# EAGLE design quadcopter_cape_v1 (EAGLE 6.5.0)
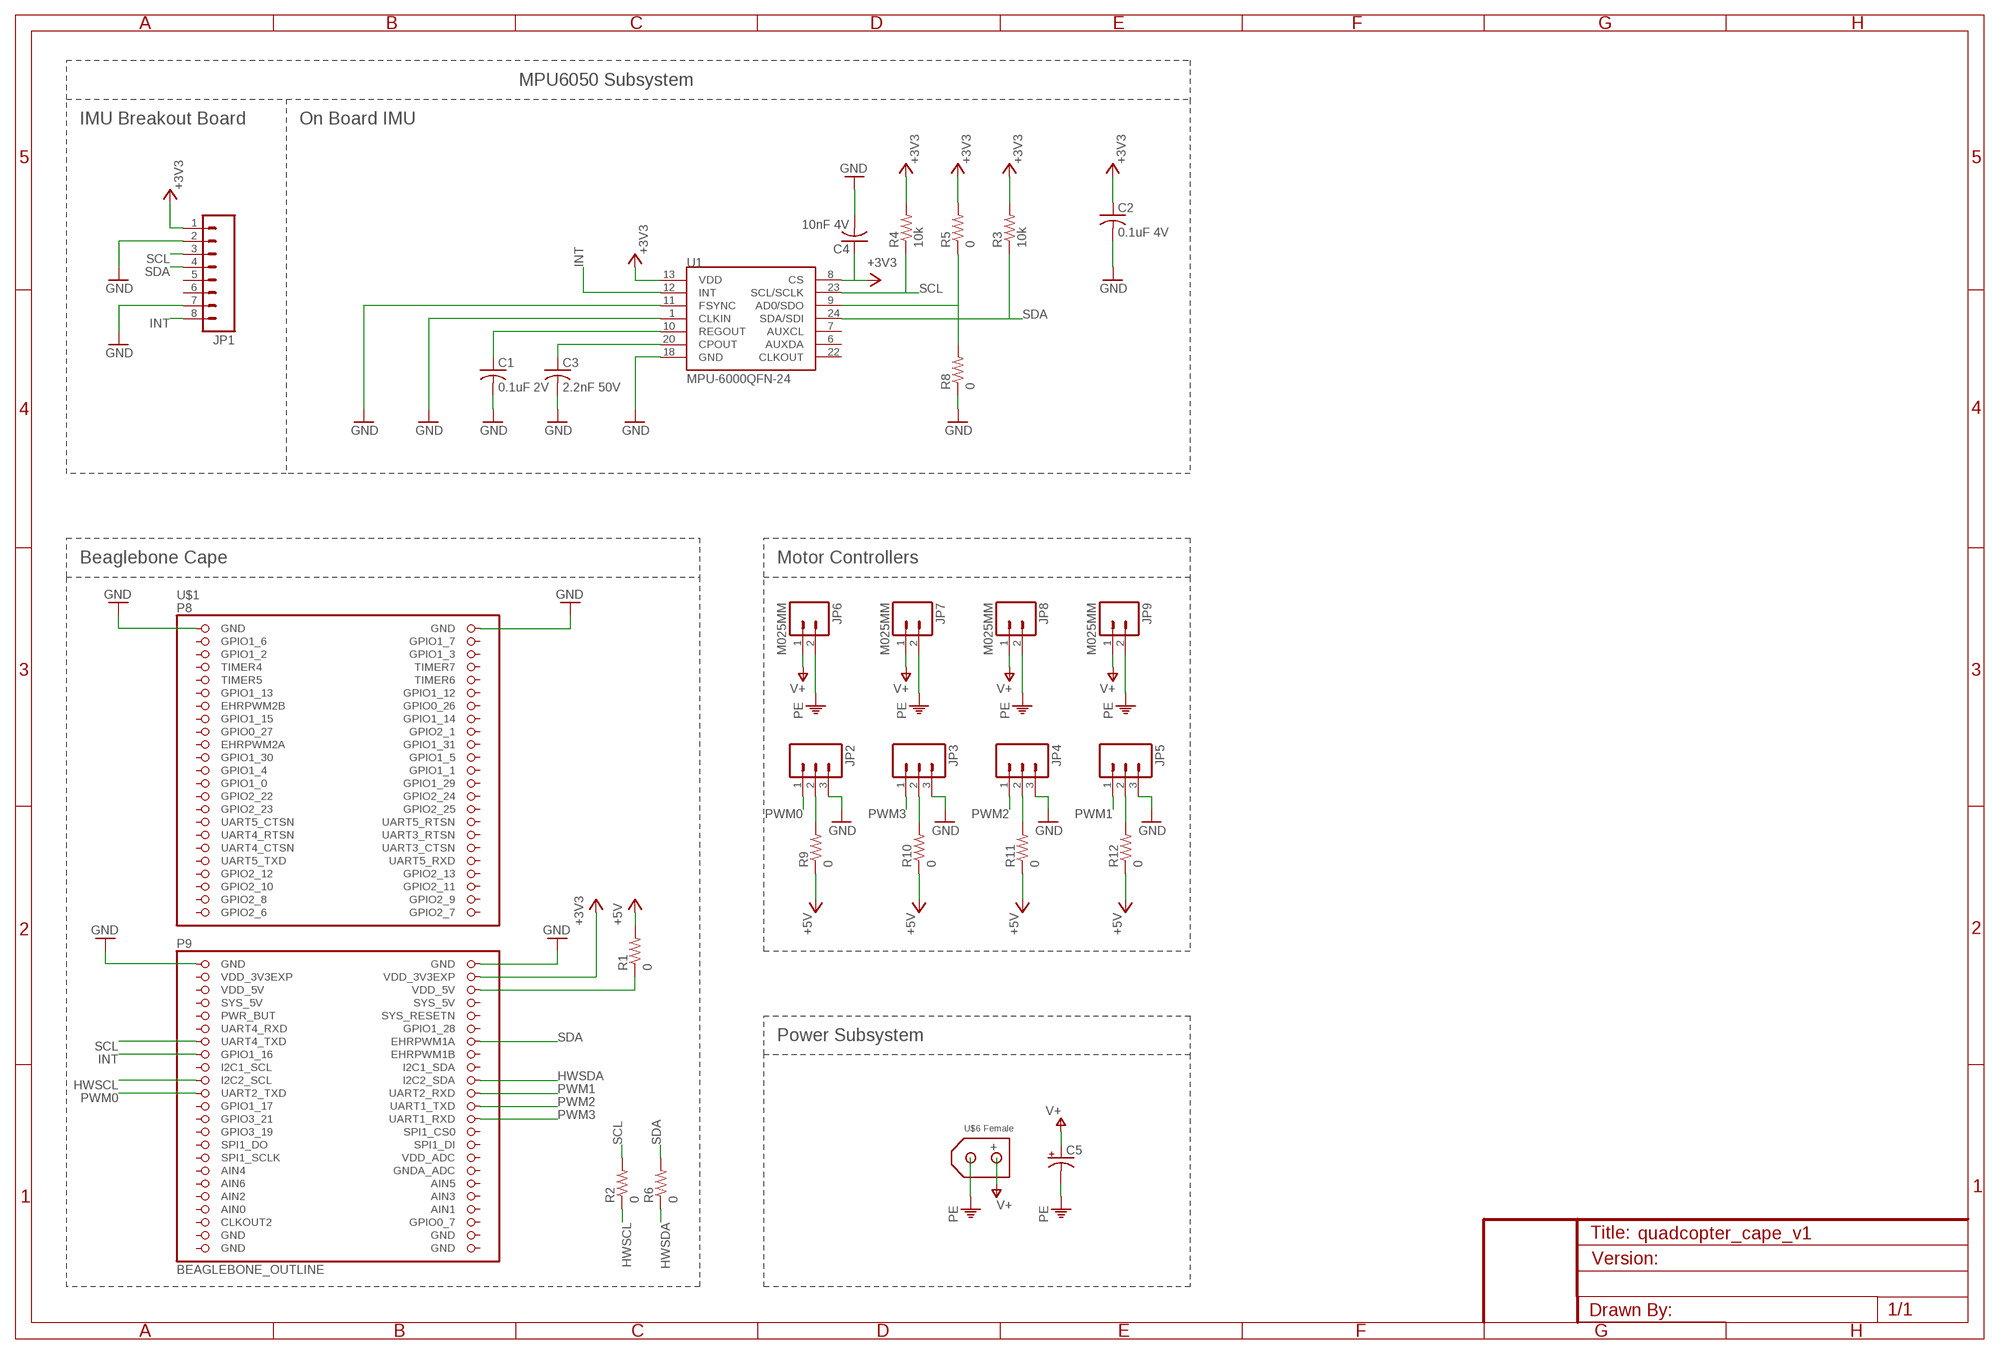
[diagram p0: schematic, sheet 1]

## Parts
C1  0.1uF 2V  C-USC0603  [C0603]
C2  0.1uF 4V  C-USC0603  [C0603]
C3  2.2nF 50V  C-USC0603  [C0603]
C4  10nF 4V  C-USC0603  [C0603]
C5  10UF-25V-20%(PTH)  [CPOL-RADIAL-10UF-25V]
JP1  M081X08  [1X08]
JP2  M03PTH  [1X03]
JP3  M03PTH  [1X03]
JP4  M03PTH  [1X03]
JP5  M03PTH  [1X03]
JP6  M025MM  [SCREWTERMINAL-5MM-2]
JP7  M025MM  [SCREWTERMINAL-5MM-2]
JP8  M025MM  [SCREWTERMINAL-5MM-2]
JP9  M025MM  [SCREWTERMINAL-5MM-2]
R1  0  R-US_R0603  [R0603]
R2  0  R-US_R0603  [R0603]
R3  10k  R-US_R0603  [R0603]
R4  10k  R-US_R0603  [R0603]
R5  0  R-US_R0603  [R0603]
R6  0  R-US_R0603  [R0603]
R8  0  R-US_R0603  [R0603]
R9  0  R-US_R0603  [R0603]
R10  0  R-US_R0603  [R0603]
R11  0  R-US_R0603  [R0603]
R12  0  R-US_R0603  [R0603]
U1  MPU-6000QFN-24  [QFN-24-TESTING]
U$1  BEAGLEBONE_OUTLINE  [BEAGLEBONE_SHIELD]
U$6  XT60  [XT60]

## Nets
+3V3: C2.1 C4.1 JP1.1 R3.2 R4.2 R5.2 U1.8(CS) U1.13(VDD) U$1.50(VDD_3V3EXP)
+5V: R1.2 R9.1 R10.1 R11.1 R12.1
GND: C1.2 C2.2 C3.2 C4.2 JP1.2 JP1.7 JP2.3 JP3.3 JP4.3 JP5.3 R8.1 U1.1(CLKIN) U1.11(FSYNC) U1.18(GND) U$1.1(GND) U$1.2(GND) U$1.47(GND) U$1.48(GND)
HWSCL: R2.1 U$1.65(I2C2_SCL)
HWSDA: R6.1 U$1.66(I2C2_SDA)
INT: JP1.8 U1.12(INT) U$1.61(GPIO1_16)
N$1: R1.1 U$1.52(VDD_5V)
N$3: C1.1 U1.10(REGOUT)
N$4: C3.1 U1.20(CPOUT)
N$5: R5.1 R8.2 U1.9(AD0/SDO)
N$10: JP2.2 R9.2
N$11: JP3.2 R10.2
N$12: JP4.2 R11.2
N$13: JP5.2 R12.2
PE: C5.2(-) JP6.2 JP7.2 JP8.2 JP9.2 U$6.GND
PWM0: JP2.1 U$1.67(UART2_TXD)
PWM1: JP5.1 U$1.68(UART2_RXD)
PWM2: JP4.1 U$1.70(UART1_TXD)
PWM3: JP3.1 U$1.72(UART1_RXD)
SCL: JP1.3 R2.2 R4.1 U1.23(SCL/SCLK) U$1.59(UART4_TXD)
SDA: JP1.4 R3.1 R6.2 U1.24(SDA/SDI) U$1.60(EHRPWM1A)
V+: C5.1(+) JP6.1 JP7.1 JP8.1 JP9.1 U$6.PWR
Unconnected: JP1.5 JP1.6 U1.6(AUXDA) U1.7(AUXCL) U1.22(CLKOUT) U$1.3(GPIO1_6) U$1.4(GPIO1_7) U$1.5(GPIO1_2) U$1.6(GPIO1_3) U$1.7(TIMER4) U$1.8(TIMER7) U$1.9(TIMER5) U$1.10(TIMER6) U$1.11(GPIO1_13) U$1.12(GPIO1_12) U$1.13(EHRPWM2B) U$1.14(GPIO0_26) U$1.15(GPIO1_15) U$1.16(GPIO1_14) U$1.17(GPIO0_27) U$1.18(GPIO2_1) U$1.19(EHRPWM2A) U$1.20(GPIO1_31) U$1.21(GPIO1_30) U$1.22(GPIO1_5) U$1.23(GPIO1_4) U$1.24(GPIO1_1) U$1.25(GPIO1_0) U$1.26(GPIO1_29) U$1.27(GPIO2_22) U$1.28(GPIO2_24) U$1.29(GPIO2_23) U$1.30(GPIO2_25) U$1.31(UART5_CTSN) U$1.32(UART5_RTSN) U$1.33(UART4_RTSN) U$1.34(UART3_RTSN) U$1.35(UART4_CTSN) U$1.36(UART3_CTSN) U$1.37(UART5_TXD) U$1.38(UART5_RXD) U$1.39(GPIO2_12) U$1.40(GPIO2_13) U$1.41(GPIO2_10) U$1.42(GPIO2_11) U$1.43(GPIO2_8) U$1.44(GPIO2_9) U$1.45(GPIO2_6) U$1.46(GPIO2_7) U$1.54(SYS_5V) U$1.55(PWR_BUT) U$1.56(SYS_RESETN) U$1.57(UART4_RXD) U$1.58(GPIO1_28) U$1.62(EHRPWM1B) U$1.63(I2C1_SCL) U$1.64(I2C1_SDA) U$1.69(GPIO1_17) U$1.71(GPIO3_21) U$1.73(GPIO3_19) U$1.74(SPI1_CS0) U$1.75(SPI1_DO) U$1.76(SPI1_DI) U$1.77(SPI1_SCLK) U$1.78(VDD_ADC) U$1.79(AIN4) U$1.80(GNDA_ADC) U$1.81(AIN6) U$1.82(AIN5) U$1.83(AIN2) U$1.84(AIN3) U$1.86(AIN1) U$1.87(CLKOUT2) U$1.88(GPIO0_7)

## Notes on the sheet
- MPU6050 Subsystem
- IMU Breakout Board | On Board IMU
- Beaglebone Cape | Motor Controllers
- Power Subsystem
- Female

## Power pins joined to a net without a drawn wire
AIN0: U$1.85(AIN0)
GND: U$1.89(GND) U$1.90(GND) U$1.91(GND) U$1.92(GND)
SYS_5V: U$1.53(SYS_5V)
VDD_3V3EXP: U$1.49(VDD_3V3EXP)
VDD_5V: U$1.51(VDD_5V)

## Library data of the parts
C1-C4 = resistor:C-US: CAPACITOR, American symbol
C5 = SparkFun-Capacitors:10UF-25V-20%(PTH): CAP-08440; PROD_ID: CAP-08440
JP1 = SparkFun-Connectors:M08: Header 8 Standard 8-pin 0.1" header. Use with straight break away headers (SKU : PRT-00116), right angle break away headers (PRT-00553), swiss pins (PRT-00743), machine pins (PRT-00117), and female headers (PRT-00115).
JP2-JP5 = SparkFun-Connectors:M03: Header 3 Standard 3-pin 0.1" header. Use with straight break away headers (SKU : PRT-00116), right angle break away headers (PRT-00553), swiss pins (PRT-00743), machine pins (PRT-00117), and female headers (PRT-00115). Molex polarized connector foot print use with SKU : PRT-08232 with associated crimp pins and housings.
JP6-JP9 = SparkFun-Connectors:M02: Standard 2-pin 0.1" header. Use with - straight break away headers ( PRT-00116) - right angle break away headers (PRT-00553) - swiss pins (PRT-00743) - machine pins (PRT-00117) - female headers (PRT-00115) Molex polarized connector foot print use with: PRT-08233 with associated crimp pins and housings. 2.54_SCREWTERM for use with PRT-10571. 3.5mm Screw Terminal footprints for PRT-08084 5mm Screw Terminal footprints for use with PRT-08433
R1-R6 R8-R12 = resistor:R-US_: RESISTOR, American symbol
U1 = SparkFun-Sensors:MPU-6000: MPU-6000 - I2C address is 0x68 with AD0 low and 0x69 with AD0 high.
U$1 = adafruit:BEAGLEBONE_OUTLINE: Should match A3 pinout - but not completely tested
U$6 = XT60:XT60

## Board
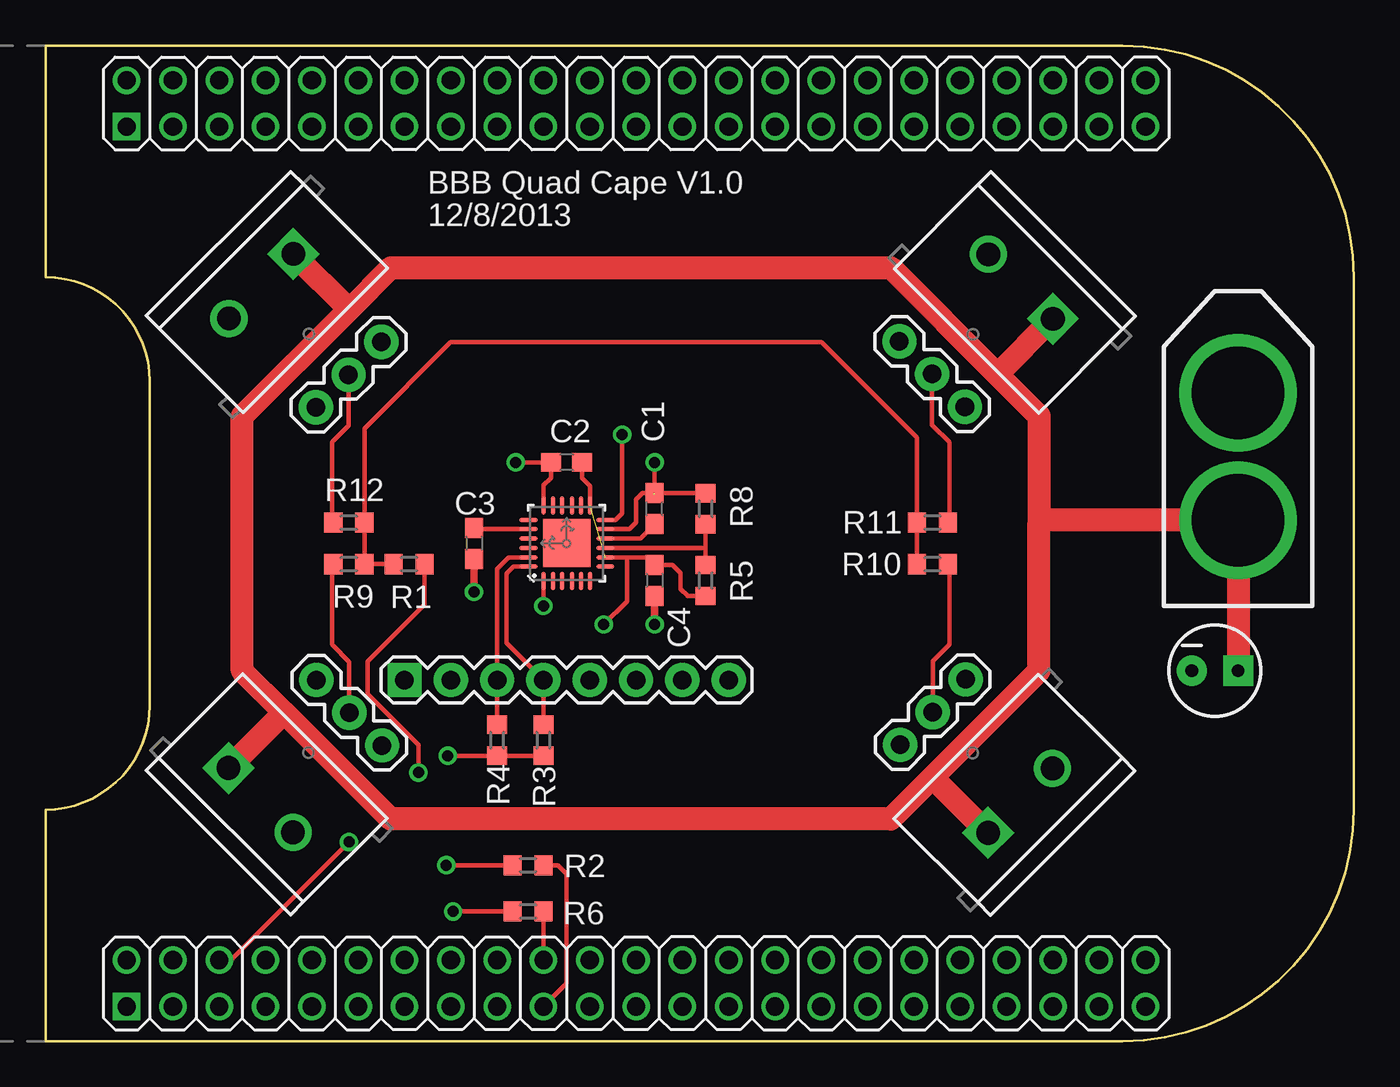
[diagram p1: board, top side]
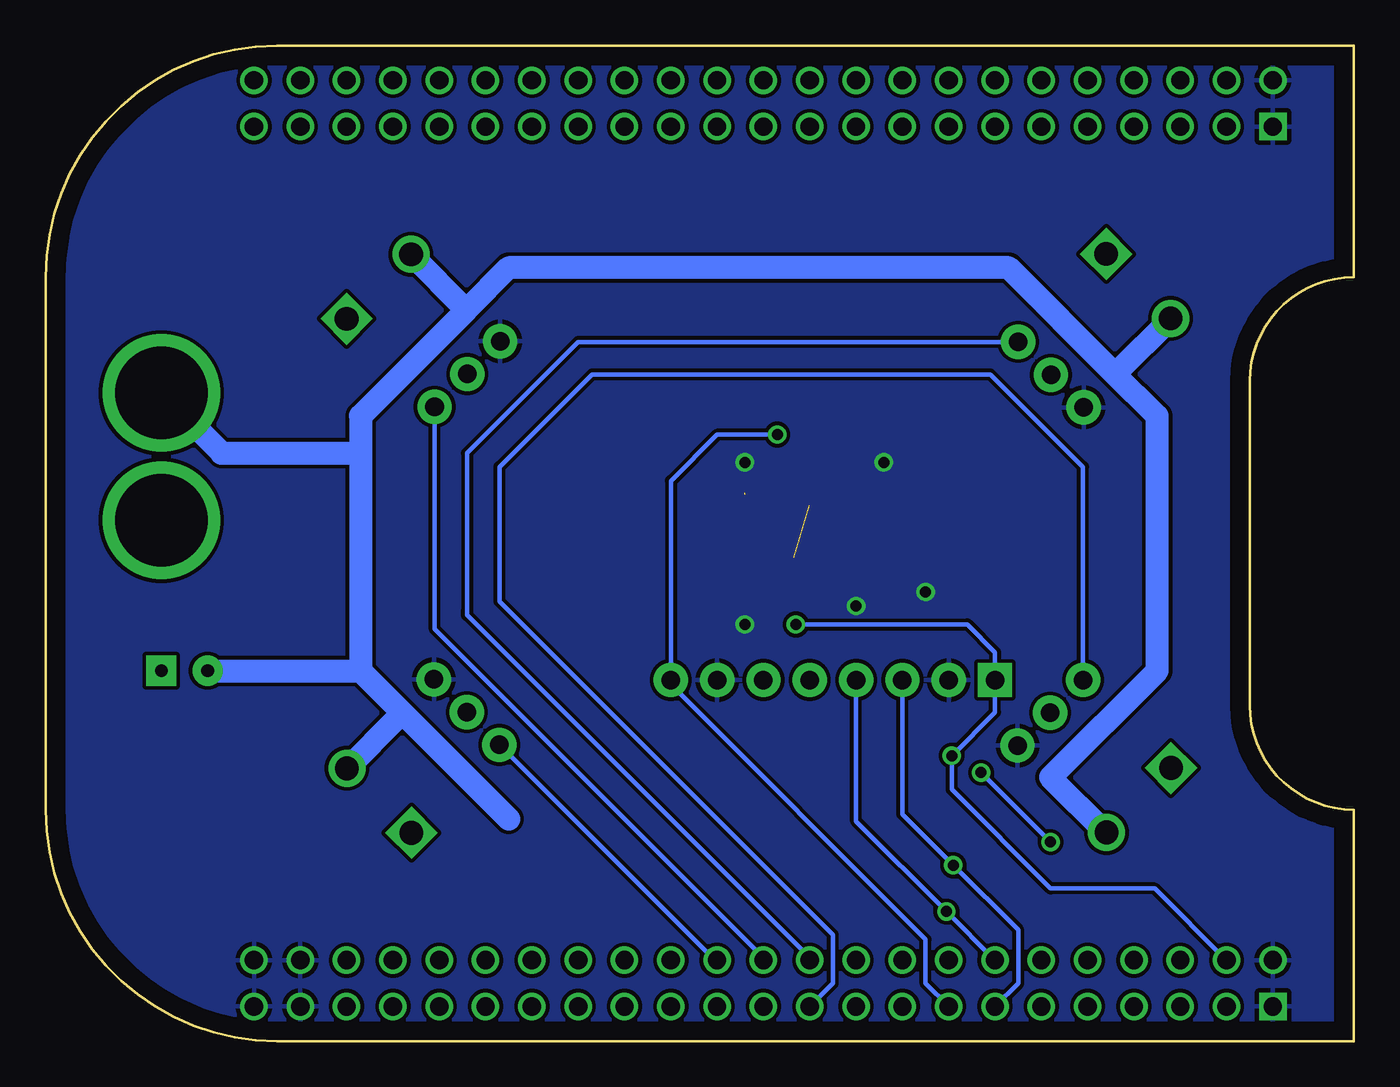
[diagram p2: board, bottom side, seen from below]

Size 71.75 x 54.61 mm. Coordinates in mm from the lower left corner, seen from the top.
Copper layers (1*16): Top 0.035mm / dielectric 1.5mm / Bottom 0.035mm
Design rules "default *": minimum track width 10mil, minimum drill 24mil, track to track 8mil, track to pad 8mil, pad to pad 8mil, via to via 8mil, smd to smd 8mil, copper to edge 40mil, drill to drill 8mil, minimum pad ring 10mil, minimum via ring 8mil, stop-mask expansion 4mil, vias tented up to drill 0mil, thermal gap 10mil

### Footprints (pad centres in the part's own frame; a part is rotated, then mirrored left to right if it is on the bottom)
C0603 = smd 1.1 x 1: 1 -0.85,0; 2 0.85,0
CPOL-RADIAL-10UF-25V = drill 0.7 pad 1.651 square: 1 1.27,0 | drill 0.7 pad 1.651: 2 -1.27,0
1X08 = drill 1.016 pad 1.88 square: 1 0,0 | drill 1.016 pad 1.88: 2 2.54,0; 3 5.08,0; 4 7.62,0; 5 10.16,0; 6 12.7,0; 7 15.24,0; 8 17.78,0
1X03 = drill 1.016 pad 1.88: 1 0,0; 2 2.54,0; 3 5.08,0
SCREWTERMINAL-5MM-2 = drill 1.3 pad 2.032 square: 1 0,0 | drill 1.3 pad 2.032: 2 5,0
R0603 = smd 1 x 1.1: 1 -0.85,0; 2 0.85,0
QFN-24-TESTING = smd 1.016 x 0.254: 1 -2.066,1.257; 2 -2.066,0.75; 3 -2.066,0.247; 4 -2.066,-0.287; 5 -2.066,-0.792; 6 -2.066,-1.297; 13 2.086,-1.297; 14 2.086,-0.792; 15 2.086,-0.287; 16 2.086,0.247; 17 2.086,0.75; 18 2.086,1.257 | smd 0.254 x 1.016: 7 -1.267,-2.122; 8 -0.762,-2.122; 9 -0.258,-2.122; 10 0.278,-2.122; 11 0.78,-2.122; 12 1.287,-2.122; 19 1.287,2.082; 20 0.78,2.082; 21 0.278,2.082; 22 -0.258,2.082; 23 -0.762,2.082; 24 -1.267,2.082 | smd 2.616 x 2.616: P$1 0.02,-0.01
BEAGLEBONE_SHIELD = drill 1 square: 1 4.445,19.05; 47 52.705,19.05 | drill 1: 2 1.905,19.05; 3 4.445,21.59; 4 1.905,21.59; 5 4.445,24.13; 6 1.905,24.13; 7 4.445,26.67; 8 1.905,26.67; 9 4.445,29.21; 10 1.905,29.21; 11 4.445,31.75; 12 1.905,31.75; 13 4.445,34.29; 14 1.905,34.29; 15 4.445,36.83; 16 1.905,36.83; 17 4.445,39.37; 18 1.905,39.37; 19 4.445,41.91; 20 1.905,41.91; 21 4.445,44.45; 22 1.905,44.45; 23 4.445,46.99; 24 1.905,46.99; 25 4.445,49.53; 26 1.905,49.53; 27 4.445,52.07; 28 1.905,52.07; 29 4.445,54.61; 30 1.905,54.61; 31 4.445,57.15; 32 1.905,57.15; 33 4.445,59.69; 34 1.905,59.69; 35 4.445,62.23; 36 1.905,62.23; 37 4.445,64.77; 38 1.905,64.77; 39 4.445,67.31; 40 1.905,67.31; 41 4.445,69.85; 42 1.905,69.85; 43 4.445,72.39; 44 1.905,72.39; 45 4.445,74.93; 46 1.905,74.93; 48 50.165,19.05; 49 52.705,21.59; 50 50.165,21.59; 51 52.705,24.13; 52 50.165,24.13; 53 52.705,26.67; 54 50.165,26.67; 55 52.705,29.21; 56 50.165,29.21; 57 52.705,31.75; 58 50.165,31.75; 59 52.705,34.29; 60 50.165,34.29; 61 52.705,36.83; 62 50.165,36.83; 63 52.705,39.37; 64 50.165,39.37; 65 52.705,41.91; 66 50.165,41.91; 67 52.705,44.45; 68 50.165,44.45; 69 52.705,46.99; 70 50.165,46.99; 71 52.705,49.53; 72 50.165,49.53; 73 52.705,52.07; 74 50.165,52.07; 75 52.705,54.61; 76 50.165,54.61; 77 52.705,57.15; 78 50.165,57.15; 79 52.705,59.69; 80 50.165,59.69; 81 52.705,62.23; 82 50.165,62.23; 83 52.705,64.77; 84 50.165,64.77; 85 52.705,67.31; 86 50.165,67.31; 87 52.705,69.85; 88 50.165,69.85; 89 52.705,72.39; 90 50.165,72.39; 91 52.705,74.93; 92 50.165,74.93
XT60 = drill 5.08 pad 6.452: GND 0,0; PWR 6.985,0

### Placement (x,y rotation side)
C1  33.4,29.21 90 top
C2  28.57,31.75 180 top
C3  23.5,27.3 270 top
C4  33.4,25.27 270 top
C5  64.13,20.32 0 top
JP1  19.68,19.81 0 top
JP2  14.86,19.81 315 top
JP3  46.86,16.26 45 top
JP4  50.42,34.8 135 top
JP5  18.42,38.35 225 top
JP6  10.03,14.99 315 top
JP7  51.69,11.43 45 top
JP8  55.24,39.62 135 top
JP9  13.59,43.18 225 top
R1  19.94,26.16 180 top
R2  26.47,9.65 180 top
R3  27.3,16.51 270 top
R4  24.76,16.51 270 top
R5  36.19,25.27 270 top
R6  26.47,7.11 180 top
R8  36.19,29.21 270 top
R9  16.64,26.16 180 top
R10  48.64,26.16 0 top
R11  48.64,28.45 0 top
R12  16.64,28.45 180 top
U1  28.57,27.3 90 top
U$1  -14.61,54.61 270 top
U$6  65.41,35.56 270 top

### Tracks (layer width: path | path; a pad name or v marks a point on that pad's centre or on a via)
+3V3  (via drill 0.6)  (1 unrouted)
  Top 0.254: 36.11,24.64 R5.2 35.2,24.42 35.2,24.43 34.82,24.82 34.82,25.68 34.39,26.11 C4.1 33.36,26.54 U1.8 31.88,26.54 31.88,24.13 v30.61,22.86 | R3.2 R4.2 v22.06,15.66 | U1.13 29.87,30.45 29.43,30.9 C2.1
  Bottom 0.254: v30.61,22.86 21.21,22.86 19.68,21.34 JP1.1 19.68,18.03 v22.06,15.66 22.06,13.8 16.64,8.38 10.92,8.38 U$1.50
+5V
  Top 0.254: R10.1 R11.1 47.79,33.11 42.55,38.35 22.22,38.35 17.49,33.62 R12.1 R9.1 R1.2
GND  (via drill 0.6)  (1 unrouted)
  Top 0.254: R8.1 C1.2 32.73,30.06 32.39,29.72 32.39,28.45 32.02,28.09 U1.11 | U1.18 27.32,30.49 27.72,30.9 C2.2 v25.78,31.75 | U1.1 27.32,23.89 v27.3,23.88 | 33.4,29.97 v33.4,31.75
  Top 0.406: C3.2 v23.5,24.64 | C4.2 v33.4,22.86
  pour Bottom: 0.13,54.61 71.75,54.61 71.75,12.7 71.75,0 58.29,0 0.13,0
HWSCL
  Top 0.254: U$1.65 28.57,3.17 28.57,9.17 28.09,9.65 R2.1
HWSDA
  Top 0.254: R6.1 U$1.66
  Top 0.406: R6.1
INT  (via drill 0.6)
  Top 0.254: U1.12 31.26,28.59 31.62,28.96 v31.62,33.27
  Bottom 0.254: U$1.61 23.5,3.17 23.5,5.59 37.47,19.56 JP1.8 37.47,30.73 34.92,33.27 v31.62,33.27
N$1  (via drill 0.6)
  Top 0.254: R1.1 20.79,23.96 17.65,20.83 17.65,19.05 20.45,16.26 v20.45,14.73 | v16.64,10.92 10.16,4.45 U$1.52
  Bottom 0.254: v20.45,14.73 v16.64,10.92
N$3
  Top 0.254: U1.10 32.62,27.58 C1.1
N$4
  Top 0.254: U1.20 23.57,28.09 C3.1
N$5
  Top 0.254: U1.9 36.19,27.05 | R5.1 36.19,27.05 | 36.19,27.05 R8.2
N$10
  Top 0.254: R9.2 15.71,26.08 15.71,21.76 16.66,20.81 JP2.2
N$11
  Top 0.254: R10.2 49.57,26.08 49.57,21.76 48.66,20.85 JP3.2
N$12
  Top 0.254: R11.2 49.57,28.53 49.57,32.85 48.62,33.8 JP4.2
N$13
  Top 0.254: R12.2 15.71,28.53 15.71,32.85 16.62,33.76 JP5.2
PE
  Bottom 1.27: JP6.2 13.61,11.45 16.64,14.48 10.79,20.32 10.79,34.29 13.21,36.7 | 13.21,36.7 18.92,42.42 46.36,42.42 48.64,40.13 | 48.64,40.13 54.48,34.29 54.48,32.26 | 54.48,32.26 54.48,20.32 | 54.48,20.32 51.94,17.78 | 51.94,17.78 46.36,12.19 | JP7.2 52.41,17.78 51.94,17.78 | JP8.2 48.68,40.13 48.64,40.13 | JP9.2 13,36.7 13.21,36.7 | U$6.GND 62.1,32.26 54.48,32.26 | C5.2 54.48,20.32
PWM0
  Bottom 0.254: U$1.67 28.57,3.17 28.57,5.84 46.86,24.13 46.86,31.5 41.78,36.58 19.94,36.58 14.86,31.5 JP2.1
PWM1
  Bottom 0.254: JP5.1 42.55,38.35 48.64,32.26 48.64,23.62 48.64,23.5 48.64,23.37 29.85,4.57 U$1.68
PWM2
  Bottom 0.254: U$1.70 32.39,4.57 50.42,22.61 JP4.1
PWM3
  Bottom 0.254: U$1.72 35.05,4.45 JP3.1
SCL  (via drill 0.6)
  Top 0.254: U1.23 25.4,26.54 24.76,25.91 JP1.3 R4.1 | R2.2 v21.97,9.65
  Bottom 0.254: U$1.59 18.42,3.17 18.42,6.1 v21.97,9.65 24.76,12.45 JP1.3
SDA  (via drill 0.6)
  Top 0.254: U1.24 25.66,26.04 25.27,25.65 25.27,21.84 JP1.4 R3.1 | R6.2 v22.35,7.11
  Bottom 0.254: U$1.60 v22.35,7.11 27.3,12.06 JP1.4
V+
  Top 1.27: JP9.1 16.64,40.13 | 16.64,40.13 18.92,42.42 46.36,42.42 52.2,36.58 | 52.2,36.58 54.48,34.29 54.48,28.45 | 48.64,14.48 54.48,20.32 54.48,28.45 | 48.64,14.48 46.36,12.19 18.92,12.19 13.08,18.03 | 13.08,18.03 10.79,20.32 10.79,34.29 16.64,40.13 | JP8.1 52.2,36.58 | JP7.1 48.64,14.48 | JP6.1 13.08,18.03 | C5.1 U$6.PWR 54.61,28.57 54.48,28.45

### Text on the board
tNames: BBB Quad Cape V1.0 | 12/8/2013